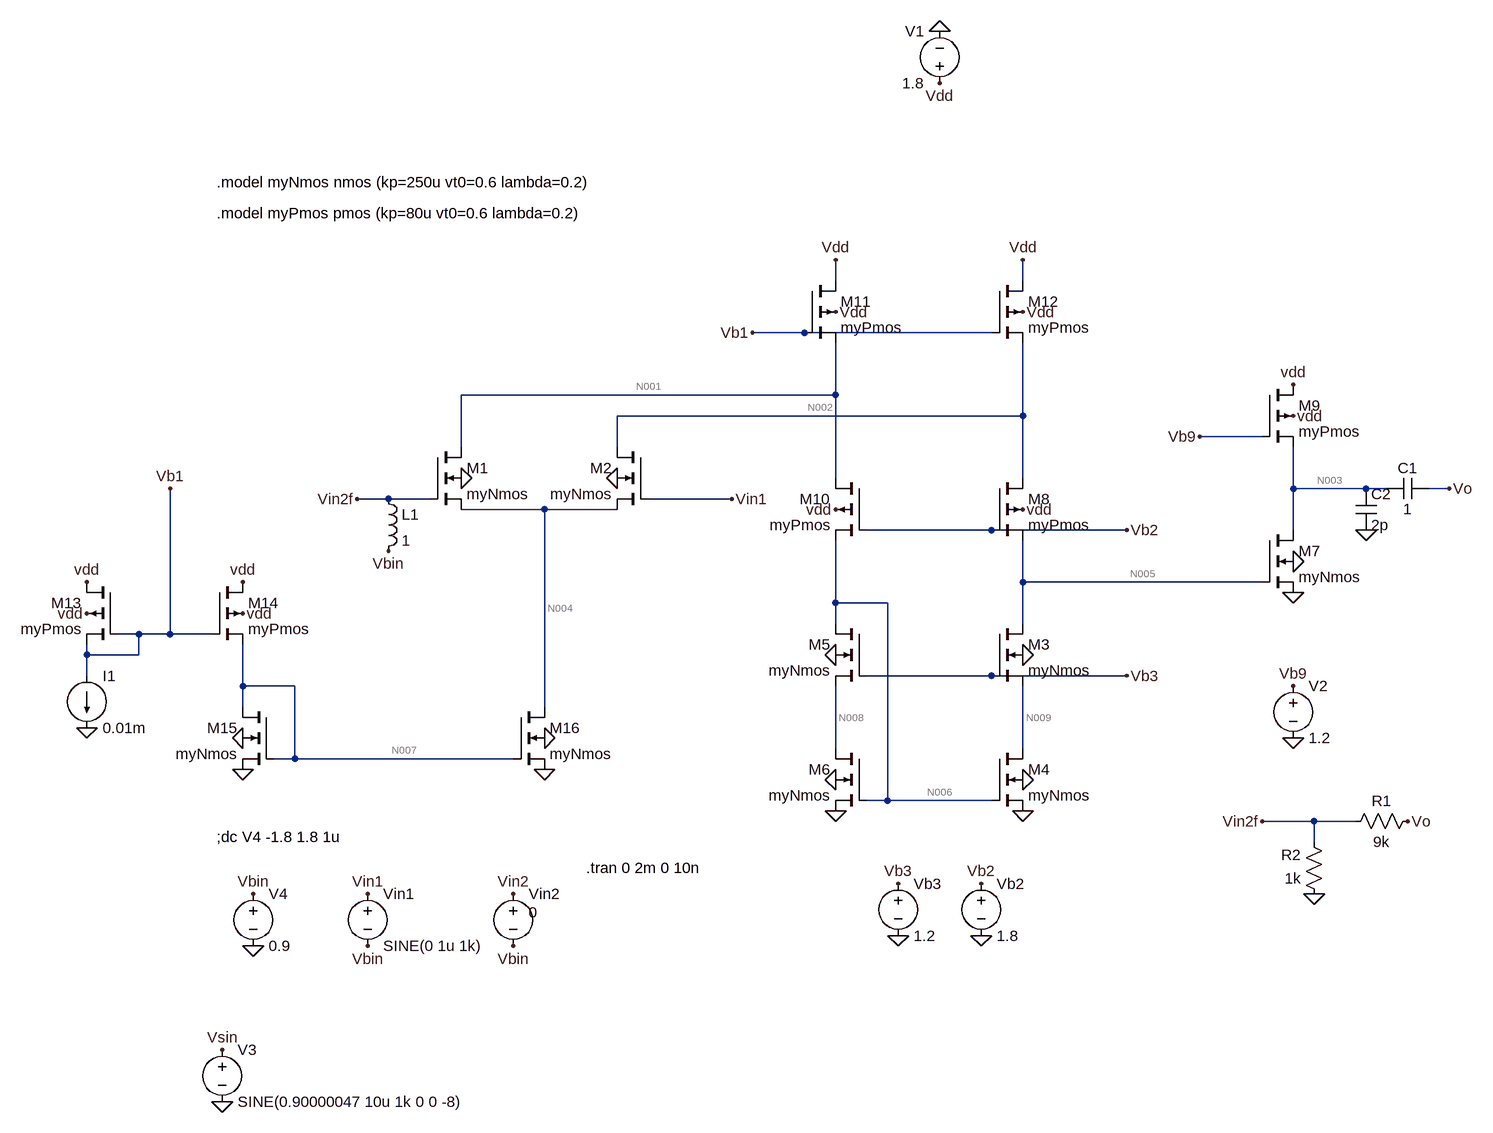
[diagram p0: schematic Draft2.asc]
Draft2.asc, the LTspice schematic file:
Version 4
SHEET 1 1872 1728
WIRE 880 208 880 176
WIRE 1168 208 1168 176
WIRE 832 288 752 288
WIRE 1120 288 832 288
WIRE 880 384 880 304
WIRE 880 384 304 384
WIRE 1168 416 1168 304
WIRE 1168 416 544 416
WIRE 1536 448 1440 448
WIRE 304 464 304 384
WIRE 544 464 544 416
WIRE 880 512 880 384
WIRE 1168 512 1168 416
WIRE 1584 528 1584 464
WIRE 1696 528 1584 528
WIRE 1728 528 1696 528
WIRE 1824 528 1792 528
WIRE 192 544 144 544
WIRE 256 544 192 544
WIRE 720 544 592 544
WIRE 432 560 304 560
WIRE 544 560 432 560
WIRE 1120 592 928 592
WIRE 1328 592 1120 592
WIRE 1584 592 1584 528
WIRE 1168 672 1168 608
WIRE 1536 672 1168 672
WIRE 880 704 880 608
WIRE 960 704 880 704
WIRE 880 736 880 704
WIRE 1168 736 1168 672
WIRE -192 752 -224 752
WIRE -144 752 -144 528
WIRE -144 752 -192 752
WIRE -80 752 -144 752
WIRE -272 784 -272 768
WIRE -192 784 -192 752
WIRE -192 784 -272 784
WIRE -272 816 -272 784
WIRE 1120 816 928 816
WIRE 1328 816 1120 816
WIRE -32 832 -32 768
WIRE 48 832 -32 832
WIRE -32 864 -32 832
WIRE 432 864 432 560
WIRE 880 928 880 832
WIRE 1168 928 1168 832
WIRE 48 944 48 832
WIRE 48 944 16 944
WIRE 384 944 48 944
WIRE 960 1008 960 704
WIRE 960 1008 928 1008
WIRE 1120 1008 960 1008
WIRE 1616 1040 1536 1040
WIRE 1680 1040 1616 1040
WIRE 1616 1072 1616 1040
FLAG 1040 -176 0
FLAG 1040 -96 Vdd
FLAG 880 176 Vdd
FLAG 1168 176 Vdd
FLAG 880 976 0
FLAG 1168 976 0
FLAG 1168 784 0
FLAG 880 784 0
FLAG 544 512 0
FLAG 304 512 0
FLAG 976 1216 0
FLAG 976 1136 Vb3
FLAG 1328 816 Vb3
FLAG 1104 1136 Vb2
FLAG 1104 1216 0
FLAG 1328 592 Vb2
FLAG 880 1024 0
FLAG 1168 1024 0
FLAG -272 896 0
FLAG 160 1152 Vin1
FLAG 384 1152 Vin2
FLAG -16 1232 0
FLAG -16 1152 Vbin
FLAG 384 1232 Vbin
FLAG 160 1232 Vbin
FLAG 144 544 Vin2f
FLAG 1168 560 vdd
FLAG 880 560 vdd
FLAG 1584 640 0
FLAG 1584 368 vdd
FLAG 1584 416 vdd
FLAG 1584 912 0
FLAG 1584 832 Vb9
FLAG 1440 448 Vb9
FLAG 1584 688 0
FLAG 1168 256 Vdd
FLAG 880 256 Vdd
FLAG -32 960 0
FLAG 432 960 0
FLAG -272 720 vdd
FLAG -32 720 vdd
FLAG -32 912 0
FLAG 432 912 0
FLAG -272 672 vdd
FLAG -32 672 vdd
FLAG -144 528 Vb1
FLAG 752 288 Vb1
FLAG 720 544 Vin1
FLAG -64 1472 0
FLAG -64 1392 Vsin
FLAG 1824 528 Vo
FLAG 1760 1040 Vo
FLAG 1616 1152 0
FLAG 1536 1040 Vin2f
FLAG 192 624 Vbin
FLAG 1696 592 0
SYMBOL voltage 1040 -80 R180
WINDOW 0 24 96 Left 2
WINDOW 3 24 16 Left 2
WINDOW 123 0 0 Left 0
WINDOW 39 0 0 Left 0
SYMATTR InstName V1
SYMATTR Value 1.8
SYMBOL current -272 816 R0
WINDOW 123 0 0 Left 0
WINDOW 39 0 0 Left 0
SYMATTR InstName I1
SYMATTR Value 0.01m
SYMBOL nmos4 256 464 R0
SYMATTR InstName M1
SYMATTR Value myNmos
SYMATTR Value2 l=0.18u w=60u
SYMBOL nmos4 592 464 M0
SYMATTR InstName M2
SYMATTR Value myNmos
SYMATTR Value2 l=0.18u w=60u
SYMBOL nmos4 1120 736 R0
SYMATTR InstName M3
SYMATTR Value myNmos
SYMATTR Value2 l=0.18u w=10u
SYMBOL nmos4 1120 928 R0
SYMATTR InstName M4
SYMATTR Value myNmos
SYMATTR Value2 l=0.18u w=10u
SYMBOL nmos4 928 736 M0
SYMATTR InstName M5
SYMATTR Value myNmos
SYMATTR Value2 l=0.18u w=10u
SYMBOL nmos4 928 928 M0
SYMATTR InstName M6
SYMATTR Value myNmos
SYMATTR Value2 l=0.18u w=10u
SYMBOL pmos4 1120 512 R0
SYMATTR InstName M8
SYMATTR Value myPmos
SYMATTR Value2 l=0.18u w=45u
SYMBOL pmos4 928 512 M0
SYMATTR InstName M10
SYMATTR Value myPmos
SYMATTR Value2 l=0.18u w=45u
SYMBOL voltage 976 1120 R0
WINDOW 123 0 0 Left 0
WINDOW 39 0 0 Left 0
SYMATTR InstName Vb3
SYMATTR Value 1.2
SYMBOL voltage 1104 1120 R0
WINDOW 123 0 0 Left 0
WINDOW 39 0 0 Left 0
SYMATTR InstName Vb2
SYMATTR Value 1.8
SYMBOL voltage 160 1136 R0
WINDOW 123 0 0 Left 0
WINDOW 39 0 0 Left 0
SYMATTR InstName Vin1
SYMATTR Value SINE(0 1u 1k)
SYMBOL voltage 384 1136 R0
WINDOW 3 24 44 Left 2
WINDOW 123 0 0 Left 0
WINDOW 39 0 0 Left 0
SYMATTR InstName Vin2
SYMATTR Value 0
SYMBOL voltage -16 1136 R0
WINDOW 123 0 0 Left 0
WINDOW 39 0 0 Left 0
SYMATTR InstName V4
SYMATTR Value 0.9
SYMBOL nmos4 1536 592 R0
SYMATTR InstName M7
SYMATTR Value myNmos
SYMATTR Value2 l=0.18u w=200u
SYMBOL pmos4 1536 368 R0
SYMATTR InstName M9
SYMATTR Value myPmos
SYMATTR Value2 l=0.18u w=3.6u
SYMBOL voltage 1584 816 R0
WINDOW 123 0 0 Left 0
WINDOW 39 0 0 Left 0
SYMATTR InstName V2
SYMATTR Value 1.2
SYMBOL pmos4 832 208 R0
SYMATTR InstName M11
SYMATTR Value myPmos
SYMATTR Value2 l=0.18u w=1u
SYMBOL pmos4 1120 208 R0
SYMATTR InstName M12
SYMATTR Value myPmos
SYMATTR Value2 l=0.18u w=1u
SYMBOL pmos4 -224 672 M0
SYMATTR InstName M13
SYMATTR Value myPmos
SYMATTR Value2 l=0.18u w=1u
SYMBOL pmos4 -80 672 R0
SYMATTR InstName M14
SYMATTR Value myPmos
SYMATTR Value2 l=0.18u w=1u
SYMBOL nmos4 16 864 M0
SYMATTR InstName M15
SYMATTR Value myNmos
SYMATTR Value2 l=0.18u w=10u
SYMBOL nmos4 384 864 R0
SYMATTR InstName M16
SYMATTR Value myNmos
SYMATTR Value2 l=0.18u w=10u
SYMBOL cap 1792 512 R90
WINDOW 0 0 32 VBottom 2
WINDOW 3 32 32 VTop 2
SYMATTR InstName C1
SYMATTR Value 1
SYMBOL voltage -64 1376 R0
WINDOW 123 0 0 Left 0
WINDOW 39 0 0 Left 0
SYMATTR InstName V3
SYMATTR Value SINE(0.90000047 10u 1k 0 0 -8)
SYMBOL res 1776 1024 R90
WINDOW 0 0 56 VBottom 2
WINDOW 3 32 56 VTop 2
SYMATTR InstName R1
SYMATTR Value 9k
SYMBOL res 1632 1168 R180
WINDOW 0 36 76 Left 2
WINDOW 3 36 40 Left 2
SYMATTR InstName R2
SYMATTR Value 1k
SYMBOL ind 176 528 R0
SYMATTR InstName L1
SYMATTR Value 1
SYMBOL cap 1680 528 R0
SYMATTR InstName C2
SYMATTR Value 2p
TEXT 496 1112 Left 2 !.tran 0 2m 0 10n
TEXT -72 56 Left 2 !.model myNmos nmos (kp=250u vt0=0.6 lambda=0.2)
TEXT -72 104 Left 2 !.model myPmos pmos (kp=80u vt0=0.6 lambda=0.2)
TEXT -72 1064 Left 2 !;dc V4 -1.8 1.8 1u

The netlist it stands for:
* Draft2.asc
V1 Vdd 0 1.8
I1 Vb1 0 0.01m
M1 N001 Vin2f N004 0 myNmos l=0.18u w=60u
M2 N002 Vin1 N004 0 myNmos l=0.18u w=60u
M3 N005 Vb3 N009 0 myNmos l=0.18u w=10u
M4 N009 N006 0 0 myNmos l=0.18u w=10u
M5 N006 Vb3 N008 0 myNmos l=0.18u w=10u
M6 N008 N006 0 0 myNmos l=0.18u w=10u
M8 N002 Vb2 N005 Vdd myPmos l=0.18u w=45u
M10 N001 Vb2 N006 Vdd myPmos l=0.18u w=45u
Vb3 Vb3 0 1.2
Vb2 Vb2 0 1.8
Vin1 Vin1 Vbin SINE(0 1u 1k)
Vin2 Vin2 Vbin 0
V4 Vbin 0 0.9
M7 N003 N005 0 0 myNmos l=0.18u w=200u
M9 Vdd Vb9 N003 Vdd myPmos l=0.18u w=3.6u
V2 Vb9 0 1.2
M11 Vdd Vb1 N001 Vdd myPmos l=0.18u w=1u
M12 Vdd Vb1 N002 Vdd myPmos l=0.18u w=1u
M13 Vdd Vb1 Vb1 Vdd myPmos l=0.18u w=1u
M14 Vdd Vb1 N007 Vdd myPmos l=0.18u w=1u
M15 N007 N007 0 0 myNmos l=0.18u w=10u
M16 N004 N007 0 0 myNmos l=0.18u w=10u
C1 Vo N003 1
V3 Vsin 0 SINE(0.90000047 10u 1k 0 0 -8)
R1 Vo Vin2f 9k
R2 0 Vin2f 1k
L1 Vin2f Vbin 1
C2 N003 0 2p
.model NMOS NMOS
.model PMOS PMOS
.lib standard.mos
.tran 0 2m 0 10n
.model myNmos nmos (kp=250u vt0=0.6 lambda=0.2)
.model myPmos pmos (kp=80u vt0=0.6 lambda=0.2)
;dc V4 -1.8 1.8 1u
.backanno
.end

* Results of the author's LTspice run, read from the files saved beside the schematic
* Operating Point, zero values left out:
*   V(vdd) = 1.8 V
*   V(vb1) = 1.764 V
*   V(n001) = 1.265 V
*   V(vin2f) = 900 mV
*   V(n004) = 268.2 mV
*   V(n002) = 1.265 V
*   V(vin1) = 900 mV
*   V(n005) = 672.3 mV
*   V(vb3) = 1.2 V
*   V(n009) = 519.3 mV
*   V(n006) = 678 mV
*   V(n008) = 519.3 mV
*   V(vb2) = 1.8 V
*   V(vbin) = 900 mV
*   V(vin2) = 900 mV
*   V(n003) = 1.247 V
*   V(vb9) = 1.2 V
*   V(n007) = 717.4 mV
*   V(vo) = 900 mV
*   V(vsin) = 900 mV
*   Id(M14) = 109.4 µA
*   Ib(M14) = 1.093 pA
*   Is(M14) = -109.4 µA
*   Id(M13) = 10 µA
*   Is(M13) = -10 µA
*   Id(M12) = 97.06 µA
*   Is(M12) = -97.06 µA
*   Id(M11) = 97.06 µA
*   Is(M11) = -97.06 µA
*   Id(M9) = 907.8 µA
*   Is(M9) = -907.8 µA
*   Id(M10) = 46.66 µA
*   Ib(M10) = 1.677 pA
*   Is(M10) = -46.66 µA
*   Id(M8) = 46.66 µA
*   Ib(M8) = 1.683 pA
*   Is(M8) = -46.66 µA
*   Id(M16) = 100.8 µA
*   Is(M16) = -100.8 µA
*   Id(M15) = 109.4 µA
*   Is(M15) = -109.4 µA
*   Id(M7) = 907.8 µA
*   Ib(M7) = -1.257 pA
*   Is(M7) = -907.8 µA
*   Id(M6) = 46.66 µA
*   Is(M6) = -46.66 µA
*   Id(M5) = 46.66 µA
*   Ib(M5) = -1.217 pA
*   Is(M5) = -46.66 µA
*   Id(M4) = 46.66 µA
*   Is(M4) = -46.66 µA
*   Id(M3) = 46.66 µA
*   Ib(M3) = -1.212 pA
*   Is(M3) = -46.66 µA
*   Id(M2) = 50.4 µA
*   Ib(M2) = -1.553 pA
*   Is(M2) = -50.4 µA
*   Id(M1) = 50.4 µA
*   Ib(M1) = -1.553 pA
*   Is(M1) = -50.4 µA
*   I(L1) = -900 µA
*   I(I1) = 10 µA
*   I(R2) = -900 µA
*   I(V4) = -900 µA
*   I(V1) = -1.221 mA
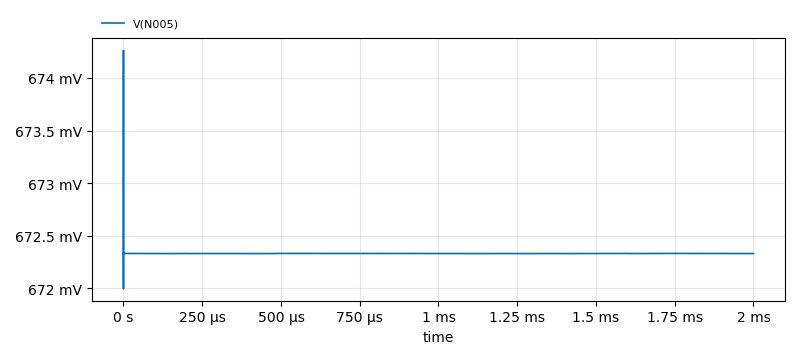
[diagram p1: Transient Analysis of Draft2.asc, plotted from the saved traces]
* Transient Analysis, 1 run:
*   V(N005): min 672 mV, max 674.3 mV, average 672.3 mV, rms 672.3 mV, last 672.3 mV